# EasyEDA Pro project ChatBOT板子.epro

# Schematic Schematic1
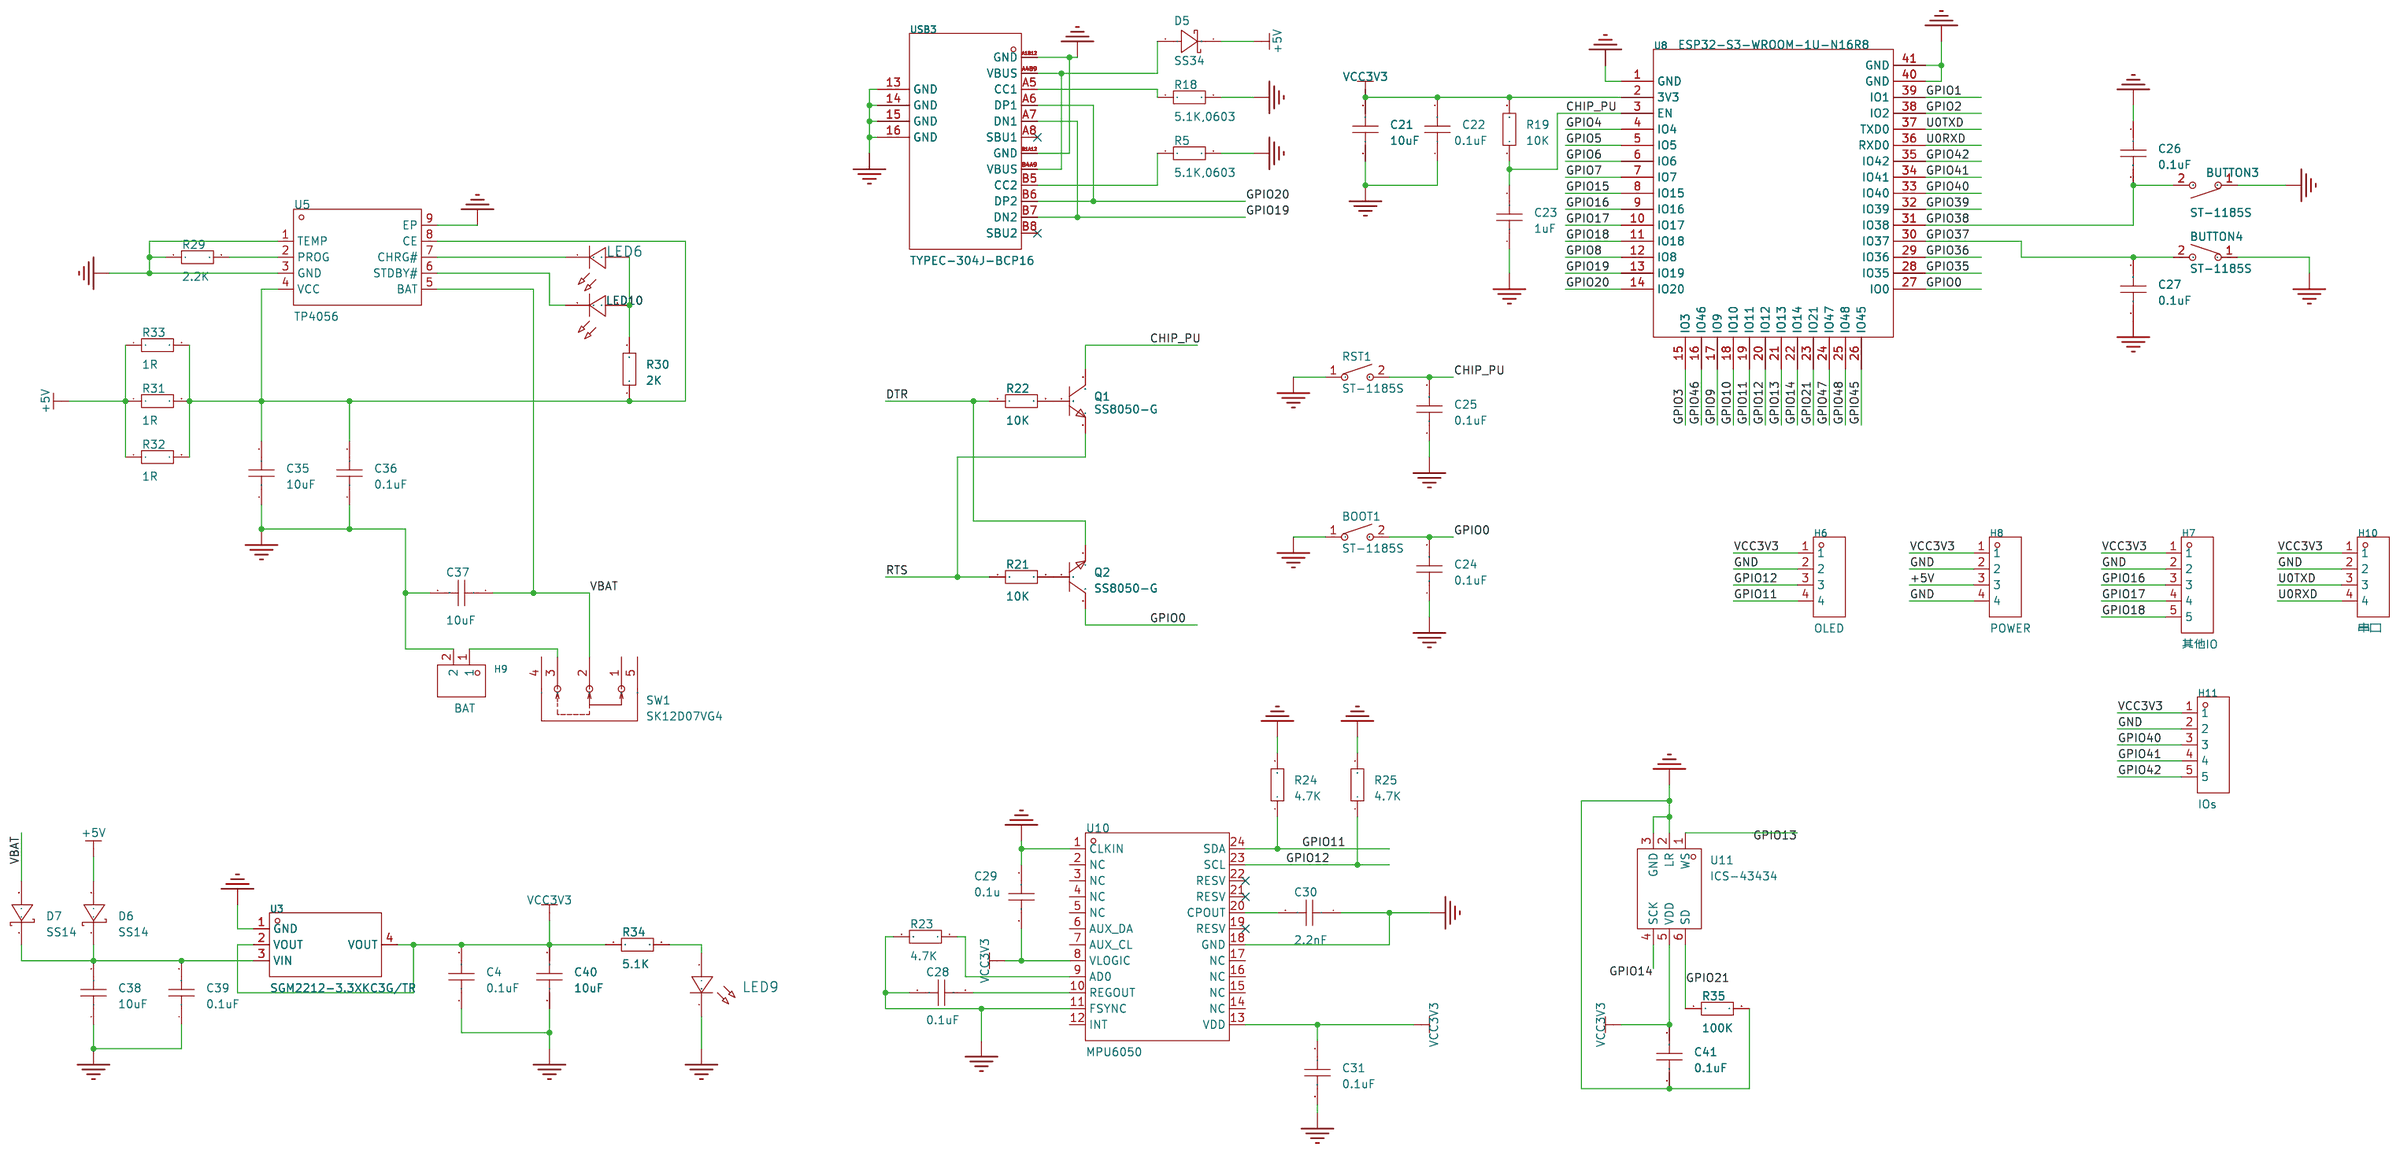
[diagram p0: schematic sheet]

## Parts
BOOT1  ST-1185S  [SW-SMD_ST-1185S]
BUTTON3  ST-1185S  [SW-SMD_ST-1185S]
BUTTON4  ST-1185S  [SW-SMD_ST-1185S]
C4  0.1uF  [C0603]
C21  10uF  [C0603]
C22  0.1uF  [C0603]
C23  1uF  [C0603]
C24  0.1uF  [C0603]
C25  0.1uF  [C0603]
C26  0.1uF  [C0603]
C27  0.1uF  [C0603]
C28  0.1uF  [C0603]
C29  0.1u  [C0603]
C30  2.2nF  [C0603]
C31  0.1uF  [C0603]
C35  10uF  [C0603]
C36  0.1uF  [C0603]
C37  10uF  [C0603]
C38  10uF  [C0603]
C39  0.1uF  [C0603]
C40  10uF  [C0603]
C41  0.1uF  [C0603]
D5  SS34  [SMA_L4.3-W2.5-LS5.0-RD]
D6  SS14  [SMA_L4.2-W2.6-LS5.3-RD]
D7  SS14  [SMA_L4.2-W2.6-LS5.3-RD]
H6  OLED  [HDR-TH_4P-P2.54-V-M]
H7  其他IO  [HDR-TH_5P-P2.54-V-M]
H8  POWER  [HDR-TH_4P-P2.54-V-M]
H9  BAT  [HDR-TH_2P-P2.54-V-M]
H10  串口  [HDR-TH_4P-P2.54-V-M]
H11  IOs  [HDR-TH_5P-P2.54-V-M]
LED6  -  [LED_0603]
LED9  -  [LED_0603]
LED10  -  [LED_0603]
Q1  SS8050-G  [SOT-23-3_L2.9-W1.6-P1.90-LS2.8-BR]
Q2  SS8050-G  [SOT-23-3_L2.9-W1.6-P1.90-LS2.8-BR]
R5  5.1K,0603  [R0603]
R18  5.1K,0603  [R0603]
R19  10K  [R0603]
R21  10K  [R0603]
R22  10K  [R0603]
R23  4.7K  [R0603]
R24  4.7K  [R0603]
R25  4.7K  [R0603]
R29  2.2K  [R0603]
R30  2K  [R0603]
R31  1R  [R0603]
R32  1R  [R0603]
R33  1R  [R0603]
R34  5.1K  [R0603]
R35  100K  [R0603]
RST1  ST-1185S  [SW-SMD_ST-1185S]
SW1  SK12D07VG4  [SW-TH_SK12D07VG4]
U3  SGM2212-3.3XKC3G/TR  [SOT-223-3_L6.5-W3.4-P2.30-LS7.0-BR]
U5  TP4056  [ESOP-8_L4.9-W3.9-P1.27-LS6.0-BL-EP]
U8  ESP32-S3-WROOM-1U-N16R8  [WIRELM-SMD_ESP32-S3-WROOM-1U]
U10  MPU6050  [QFN-24_L4.0-W4.0-P0.50-BL]
U11  ICS-43434  [MIC-SMD_6P-L3.5-W2.7-P0.90-TR]
USB3  TYPEC-304J-BCP16  [USB-C-SMD_TYPEC-304J-BCP16]

## Library data of the parts
BOOT1 BUTTON3 BUTTON4 RST1 = ST-1185S: 触点电流:50mA;额定电压(DC):12V;绝缘电阻:100MΩ;电路结构:单刀单掷;安装方式:立贴;机械寿命:10万次;带支架:否;; LCSC Part Name: 4*3*2mm 立贴 轻触开关; Supplier Part: C589191; Manufacturer: RISHENG(日昇); Supplier Footprint: SMD; JLCPCB Part Class: 扩展库; Datasheet: https://atta.szlcsc.com/upload/public/pdf/source/20200922/C589191_E74F821EA1C61BCC16EBC99CF1D66EDD.pdf; Supplier: LCSC; Circuit: 单刀单掷; Actuator Style: 圆形按钮; Mounting Style: 立贴; Switch Length: 4mm; Switch Width: 3mm; Switch Height: 2mm; Strike Gundam: 否; Contact Current: 50mA; Voltage Rating (DC): 12V; Insulation Resistance: 100MΩ; Actuator/Cap Color: 黑色; Pin Style: SMD接片; Mechanical Life: 10万次; Operating Temperature: -20℃~+70℃
C4 C21-C31 C35-C41 = CAP_0603: Supplier Footprint: 0603
D5 = SS34_C727060: 二极管配置:独立式;直流反向耐压(Vr):40V;平均整流电流(Io):3A;正向压降(Vf):550mV@3A;; LCSC Part Name: 40V 3A 550mV@3A; Supplier Part: C727060; Manufacturer: TWGMC(台湾迪嘉); Supplier Footprint: SMA; JLCPCB Part Class: 扩展库; Datasheet: https://atta.szlcsc.com/upload/public/pdf/source/20200828/C727059_6599B6CAC5F3238B9C33E46794659DBE.pdf; Supplier: LCSC; Diode Configuration: 独立式; Forward Voltage (Vf@If): 550mV@3A; Reverse Voltage (Vr): 40V; Average Rectified Current (Io): 3A; Reverse Leakage Current (Ir): 500uA@40V
D6 D7 = SS14_C2480: 二极管配置:独立式;正向压降(Vf):550mV@1A;直流反向耐压(Vr):40V;平均整流电流(Io):1A;; LCSC Part Name: 电压:40V 电流:1A; Supplier Part: C2480; Manufacturer: MDD; Supplier Footprint: SMA(DO-214AC); JLCPCB Part Class: Basic Part; Datasheet: https://atta.szlcsc.com/upload/public/pdf/source/20230712/2DB6064CFBB99DE6DB116BEE8208BE66.pdf; Supplier: LCSC; Diode Configuration: 独立式; Forward Voltage (Vf@If): 550mV@1A; Reverse Voltage (Vr): 40V; Average Rectified Current (Io): 1A; Reverse Leakage Current (Ir): 500uA@40V
H6 H8 H10 = PZ254V-11-04P: 排数:单排;总PIN位数:4P;间距:2.54mm;插针结构:1x4P;行距:-;安装类型:直插;圆针/方针:方针;额定电流:3A;额定电压:250V;配合针长度:6mm;塑高:2.5mm;端接针长度:3mm;触头材质:-;工作温度范围:-40℃~+105℃;颜色:黑色;; LCSC Part Name: 2.54mm 1x4P 直插 方针; Supplier Part: C2691448; Manufacturer: XFCN(兴飞); Supplier Footprint: 插件,P=2.54mm; JLCPCB Part Class: 扩展库; Datasheet: https://atta.szlcsc.com/upload/public/pdf/source/20200309/C492403_F9F19131791D08044AD4F84F8E751A34.pdf; Supplier: LCSC; Number of Rows: 单排; Number of Pins: 4P; Pitch: 2.54mm; Pin Structure: 1x4P; Mounting Type: 直插; Circluar Pins/Square Pins: 方针; Current Rating (Max): 3A; Voltage Rating (Max): 250V; Length of Mating Pin: 6mm; Insulation Height: 2.5mm; Length of End Connection Pin: 3mm; Operating Temperature Range: -40℃~+105℃; Color: 黑色
H7 H11 = PZ254V-11-05P: 排数:单排;总PIN位数:5P;间距:2.54mm;插针结构:1x5P;行距:-;安装类型:直插;圆针/方针:方针;额定电流:-;额定电压:-;配合针长度:6mm;塑高:2.5mm;端接针长度:3mm;触头材质:黄铜;触头镀层:-;工作温度范围:-40℃~+105℃;颜色:黑色;; LCSC Part Name: 2.54mm 1x5P 直插 方针; Supplier Part: C492404; Manufacturer: XFCN(兴飞); Supplier Footprint: 插件,P=2.54mm; JLCPCB Part Class: 扩展库; Datasheet: https://atta.szlcsc.com/upload/public/pdf/source/20200309/C492404_E51533260F8710EFF5D4617281164C1D.pdf; Supplier: LCSC; Pin Structure: 1x5P; Pitch: 2.54mm; Circluar Pins/Square Pins: 方针; Mounting Type: 直插; Number of Rows: 单排; Number of Pins: 5P; Length of Mating Pin: 6mm; Insulation Height: 2.5mm; Length of End Connection Pin: 3mm; Contact Material: 黄铜; Operating Temperature Range: -40℃~+105℃; Color: 黑色
H9 = PZ254V-11-02P: 排数:单排;总PIN位数:2P;间距:2.54mm;插针结构:1x2P;行距:-;安装类型:直插;圆针/方针:方针;额定电流:-;额定电压:-;配合针长度:6mm;塑高:2.5mm;端接针长度:3mm;触头材质:黄铜;触头镀层:-;工作温度范围:-40℃~+105℃;颜色:黑色;; LCSC Part Name: 2.54mm 1x2P 直插 方针; Supplier Part: C492401; Manufacturer: XFCN(兴飞); Supplier Footprint: 插件,P=2.54mm; JLCPCB Part Class: Extended Part; Datasheet: https://atta.szlcsc.com/upload/public/pdf/source/20200309/C492401_A812433581A9B211A7FFA413ADDFF0E5.pdf; Supplier: LCSC; Number of Rows: 单排; Number of Pins: 2P; Pitch: 2.54mm; Pin Structure: 1x2P; Mounting Type: 直插; Circluar Pins/Square Pins: 方针; Length of Mating Pin: 6mm; Insulation Height: 2.5mm; Length of End Connection Pin: 3mm; Contact Material: 黄铜; Operating Temperature Range: -40℃~+105℃; Color: 黑色
LED6 LED9 = LED_0603-R: Supplier Footprint: 0603
LED10 = LED_0603-G: Supplier Footprint: 0603
Q1 Q2 = SS8050-G_C164886: 晶体管类型:NPN;集射极击穿电压(Vceo):25V;集电极电流(Ic):1.5A;功率(Pd):300mW;直流电流增益(hFE@Ic,Vce):120@100mA,1V;; LCSC Part Name: NPN 25V 1.5A L档(120-200); Supplier Part: C164886; Manufacturer: CJ(江苏长电/长晶); Supplier Footprint: SOT-23; JLCPCB Part Class: 扩展库; Datasheet: https://atta.szlcsc.com/upload/public/pdf/source/20171228/C164886_15144412883891213890.pdf; Supplier: LCSC; Transistor Type: NPN; Collector-Emitter Breakdown Voltage (Vceo): 25V; Collector Current (Ic): 1.5A; Power Dissipation (Pd): 300mW; Collector Cut-Off Current (Icbo): 100nA; Collector-Emitter Saturation Voltage (VCE(sat)@Ic,Ib): 500mV@800mA,80mA; DC Current Gain (hFE@Ic,Vce): 120@100mA,1V; Transition Frequency (fT): 100MHz; Operating Temperature: +150℃@(Tj)
R5 R18 R19 R21-R25 R29-R35 = Res_0603: Supplier Footprint: 0603
SW1 = SK12D07VG4: 电路结构:单刀双掷;安装方式:卧插;额定电流(DC):500mA;额定电压(DC):50V;额定电流(AC):-;额定电压(AC):-;机械寿命:5千次;; LCSC Part Name: 3脚2档位 卧插 滑动开关; Supplier Part: C393937; Manufacturer: SHOU HAN(首韩); Supplier Footprint: 插件; JLCPCB Part Class: 扩展库; Datasheet: https://atta.szlcsc.com/upload/public/pdf/source/20190521/C393937_939FE26E571CC67D2D532E953108A1B0.pdf; Supplier: LCSC; Circuit: 单刀双掷; Actuator Style: 矩形柱状; Pin Style: PC引脚; Switch Height: 8.8mm; Mounting Style: 卧插; Current Rating (DC): 500mA; Voltage Rating (DC): 50V; Mechanical Life: 5千次
U3 = SGM2212-3.3XKC3G/TR_C3294699: Supplier Part: C3294699; Manufacturer: SGMICRO(圣邦微); Supplier Footprint: SOT-223; JLCPCB Part Class: 扩展库; Supplier: LCSC
U5 = TP4056_C725790: Supplier Part: C725790; Manufacturer: UMW(友台半导体); Supplier Footprint: ESOP-8; JLCPCB Part Class: 扩展库; Datasheet: https://atta.szlcsc.com/upload/public/pdf/source/20231109/CF74897CE79A500F7FE27A45ADCCC631.pdf; Supplier: LCSC
U8 = ESP32-S3-WROOM-1U-N16R8: Supplier Part: C3013946; Manufacturer: ESPRESSIF(乐鑫); Supplier Footprint: SMD,18x19.2mm; JLCPCB Part Class: 扩展库; Datasheet: https://atta.szlcsc.com/upload/public/pdf/source/20240130/9D71F4DF55874C504AB629FEEE3F038E.pdf; Supplier: LCSC
U10 = MPU6050: Supplier Part: C9900042518; Supplier Footprint: QFN-24_L4.0-W4.0-P0.50-BL-EP2.7; Supplier: LCSC
U11 = ICS-43434_1: 方向:全指向;信噪比:64dB;灵敏度:-;; Supplier Part: C5656610; Manufacturer: TDK InvenSense(应美盛); JLCPCB Part Class: 扩展库; Datasheet: https://atta.szlcsc.com/upload/public/pdf/source/231023/DS-000069-ICS-43434-v1.2-8194c7772d771e21a553109502704f97.pdf; Supplier: LCSC; Direction: 全指向; Supply Voltage: 1.65V~3.63V; Current Consumption: 550uA; SNR(Signal to Noise Ratio): 64dB
USB3 = TYPEC-304J-BCP16: 连接器类型:Type-C;标准:USB 3.1;公母:母座;触点数量:16;端口数量:1;安装方式:卧贴;额定电流 - 电源:5A;工作温度范围:-40℃~+85℃;焊接温度(最大值):260℃;; LCSC Part Name: Type-C 母座 卧贴 脚长2.0; Supplier Part: C2835315; Manufacturer: XUNPU(讯普); Supplier Footprint: SMD,8.94x7.35x3.16mm; JLCPCB Part Class: 扩展库; Datasheet: https://atta.szlcsc.com/upload/public/pdf/source/20210528/C2835315_A76BD3CF9329D12B6041421AD23BFD66.pdf; Supplier: LCSC; Connector Type: Type-C; Standard: USB 3.1; Gender: 母座; Number of Ports: 1; Number of Contacts: 16; Mounting Style: 卧贴; Current Rating - Power (Max): 5A; Operating Temperature Range: -40℃~+85℃; Soldering Temperature(Max): 260℃; Welding Temperature (Max): 260℃

## Nets
+5V: D5.1(C) D6.2(A) H8.3 R31.1 R32.1 R33.1
GND: BOOT1.1 BUTTON3.1 BUTTON4.1 C4.1 C21.1 C22.1 C23.1 C24.1 C25.1 C26.1 C27.1 C28.1 C29.1 C30.1 C31.2 C35.1 C36.1 C37.2 C38.1 C39.1 C40.1 C41.1 H6.2 H7.2 H8.2 H8.4 H9.2 H10.2 H11.2 LED9.1(C) R5.2 R18.2 R23.2 R24.2 R25.2 R29.1 R35.2 RST1.1 U3.1(GND) U5.1(TEMP) U5.3(GND) U5.9(EP) U8.1(GND) U8.40(GND) U8.41(GND) U10.1(CLKIN) U10.11(FSYNC) U10.18(GND) U11.2(LR) U11.3(GND) USB3.13(GND) USB3.14(GND) USB3.15(GND) USB3.16(GND) USB3.A1B12(GND) USB3.B1A12(GND)
VBAT: C37.1 D7.2(A) SW1.2 U5.5(BAT)
VCC3V3: C4.2 C21.2 C22.2 C29.2 C31.1 C40.2 C41.2 H6.1 H7.1 H8.1 H10.1 H11.1 R19.2 R34.1 U3.2(VOUT) U3.4(VOUT) U8.2(3V3) U10.8(VLOGIC) U10.13(VDD) U11.5(VDD)
CHIP_PU: C23.2 C25.2 Q1.3(C) R19.1 RST1.2 U8.3(EN)
DTR: Q2.2(E) R22.1
GPIO0: BOOT1.2 C24.2 Q2.3(C) U8.27(IO0)
GPIO1: U8.39(IO1)
GPIO2: U8.38(IO2)
GPIO3: U8.15(IO3)
GPIO4: U8.4(IO4)
GPIO5: U8.5(IO5)
GPIO6: U8.6(IO6)
GPIO7: U8.7(IO7)
GPIO8: U8.12(IO8)
GPIO9: U8.17(IO9)
GPIO10: U8.18(IO10)
GPIO11: H6.4 R24.1 U8.19(IO11) U10.24(SDA)
GPIO12: H6.3 R25.1 U8.20(IO12) U10.23(SCL)
GPIO13: U8.21(IO13) U11.1(WS)
GPIO14: U8.22(IO14) U11.4(SCK)
GPIO15: U8.8(IO15)
GPIO16: H7.3 U8.9(IO16)
GPIO17: H7.4 U8.10(IO17)
GPIO18: H7.5 U8.11(IO18)
GPIO19: U8.13(IO19) USB3.A7(DN1) USB3.B7(DN2)
GPIO20: U8.14(IO20) USB3.A6(DP1) USB3.B6(DP2)
GPIO21: R35.1 U8.23(IO21) U11.6(SD)
GPIO35: U8.28(IO35)
GPIO36: U8.29(IO36)
GPIO37: BUTTON4.2 C27.2 U8.30(IO37)
GPIO38: BUTTON3.2 C26.2 U8.31(IO38)
GPIO39: U8.32(IO39)
GPIO40: H11.3 U8.33(IO40)
GPIO41: H11.4 U8.34(IO41)
GPIO42: H11.5 U8.35(IO42)
GPIO45: U8.26(IO45)
GPIO46: U8.16(IO46)
GPIO47: U8.24(IO47)
GPIO48: U8.25(IO48)
RTS: Q1.2(E) R21.1
U0RXD: H10.4 U8.36(RXD0)
U0TXD: H10.3 U8.37(TXD0)
$1N12556: D5.2(A) USB3.A4B9(VBUS) USB3.B4A9(VBUS)
$1N12557: R18.1 USB3.A5(CC1)
$1N12558: R5.1 USB3.B5(CC2)
$1N12699: Q2.1(B) R21.2
$1N12700: Q1.1(B) R22.2
$1N13120: R23.1 U10.9(AD0)
$1N13127: C30.2 U10.20(CPOUT)
$1N14902: LED9.2(A) R34.2
$1N14905: R29.2 U5.2(PROG)
$1N14907: LED6.1(C) U5.7(CHRG#)
$1N14908: LED10.1(C) U5.6(STDBY#)
$1N14909: LED6.2(A) LED10.2(A) R30.2
$1N14916: C38.2 C39.2 D6.1(K) D7.1(K) U3.3(VIN)
$1N14919: C35.2 C36.2 R30.1 R31.2 R32.2 R33.2 U5.4(VCC) U5.8(CE)
$1N14937: H9.1 SW1.3
$1N18410: C28.2 U10.10(REGOUT)

Not connected (* = marked no-connect by the designer): SW1 1 4 5; U10 2(NC) 3(NC) 4(NC) 5(NC) 6(AUX_DA) 7(AUX_CL) 12(INT) 14(NC) 15(NC) 16(NC) 17(NC) 19(RESV)* 21(RESV)* 22(RESV)*; USB3 A8(SBU1)* B8(SBU2)*

# Board PCB2
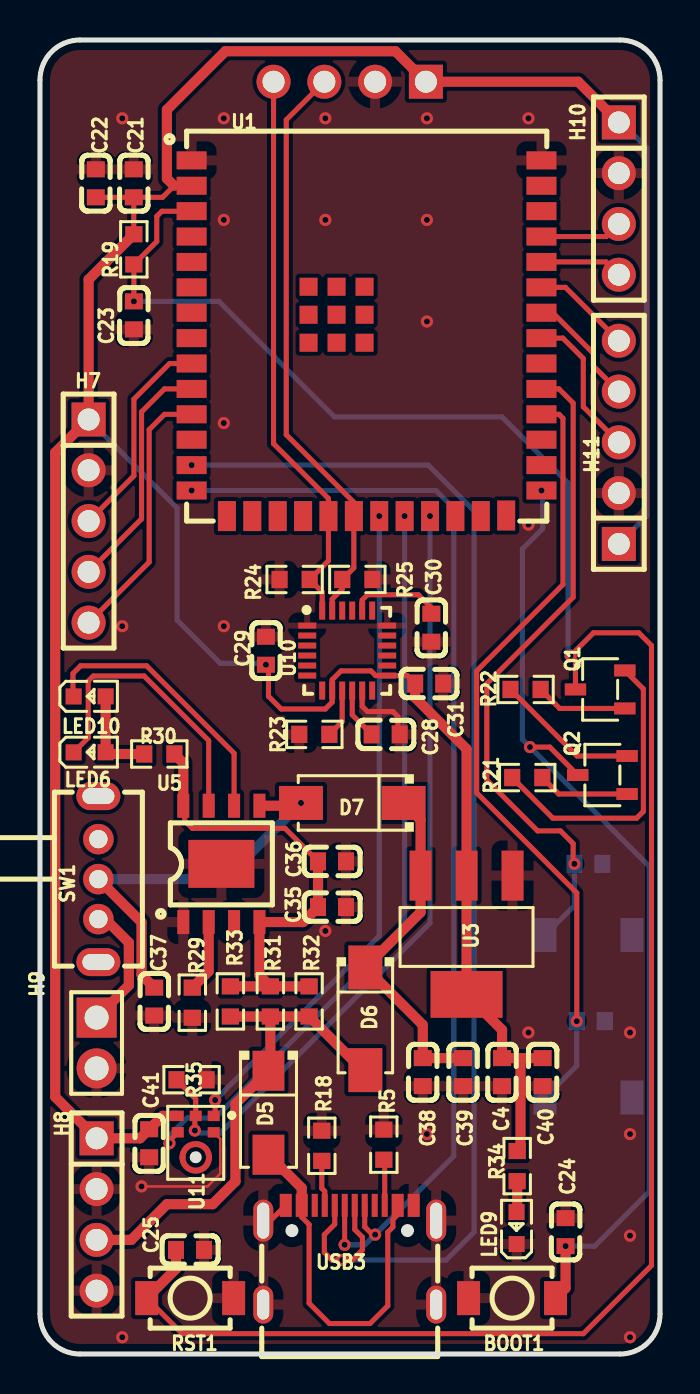
[diagram p1: board, top side]
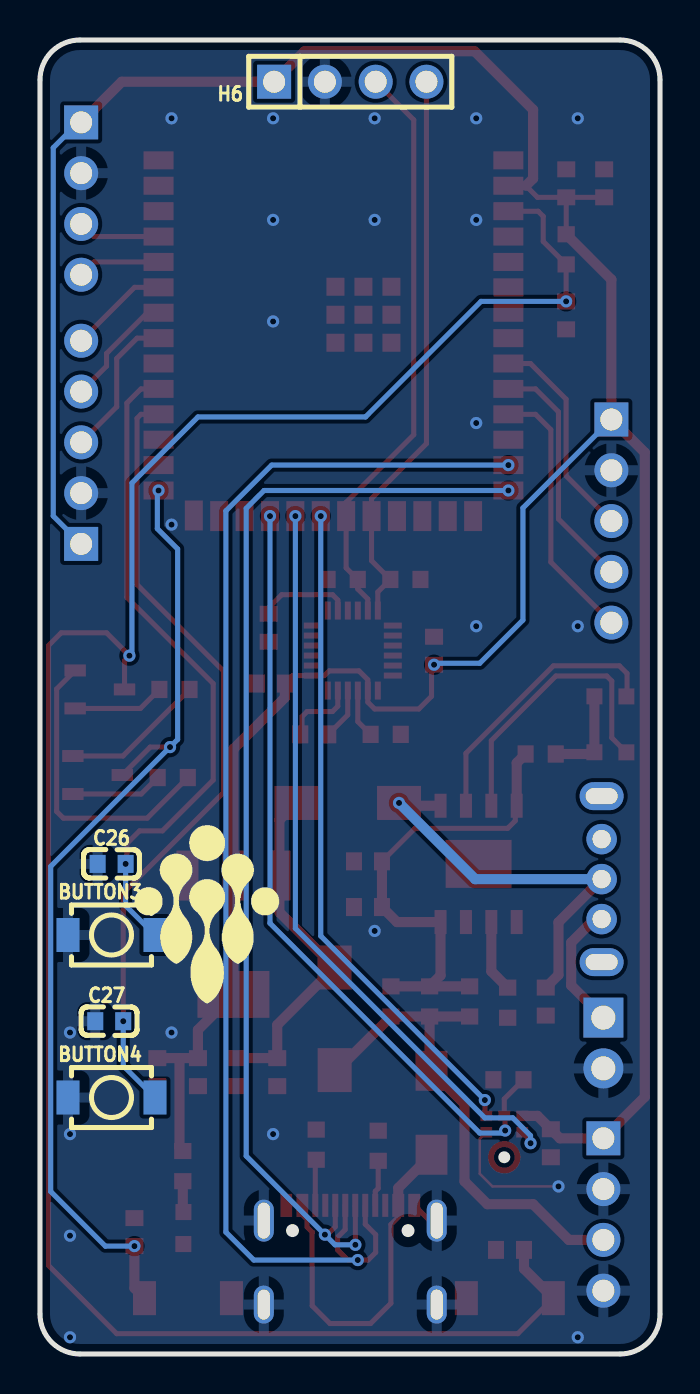
[diagram p2: board, bottom side, seen from below]

Outline 31.02 x 65.72 mm; copper layers: Top Layer, Bottom Layer. Coordinates in mm from the lower left corner of the outline.
Outline path: 0,63.72 0,2 arc(0.59,0.59) 2,0 29.02,0 arc(30.43,0.59) 31.02,2 31.02,63.72 arc(30.43,65.13) 29.02,65.72 2,65.72 arc(0.59,65.13) 0,63.72
Stack: Top Layer 0.035mm / Dielectric1 1.51mm FR4 er 4.5 / Bottom Layer 0.035mm

## Design rules (mm)
template: JLCPCB Capability(Two Layers Board)
spacing copperThickness1oz (default): track to track 0.102, other pairs 0.152 to 0.3
spacing copperThickness2oz: track to track 0.203, other pairs 0.152 to 0.3
track width copperThickness1oz (default): min 0.127, default 0.254, max 2.54
track width copperThickness2oz: min 0.203, default 0.254, max 2.54
differential pair differentialPair (default): width min 0.127, default 0.254, max 2.54; gap min 0.152, default 0.152
via viaSize (default): diameter min 0.5, default 0.61, max 10; hole min 0.3, default 0.305, max 6.3

## Placement (name value [footprint] x y rotation side)
BOOT1  ST-1185S  [SW-SMD_ST-1185S]  23.61 2.79 0 top
BUTTON3  ST-1185S  [SW-SMD_ST-1185S]  27.44 20.95 180 bottom
BUTTON4  ST-1185S  [SW-SMD_ST-1185S]  27.44 12.83 180 bottom
C4  0.1uF  [C0603]  23.11 14.1 90 top
C21  10uF  [C0603]  4.69 58.55 270 top
C22  0.1uF  [C0603]  2.79 58.55 270 top
C23  1uF  [C0603]  4.7 51.94 90 top
C24  0.1uF  [C0603]  26.29 6.1 270 top
C25  0.1uF  [C0603]  7.5 5.21 180 top
C26  0.1uF  [C0603]  27.43 24.51 180 bottom
C27  0.1uF  [C0603]  27.55 16.64 180 bottom
C28  0.1uF  [C0603]  17.29 30.99 180 top
C29  0.1u  [C0603]  11.3 35.17 270 top
C30  2.2nF  [C0603]  19.58 36.32 90 top
C31  0.1uF  [C0603]  19.47 33.53 0 top
C35  10uF  [C0603]  14.61 22.35 180 top
C36  0.1uF  [C0603]  14.61 24.64 180 top
C37  10uF  [C0603]  5.72 17.62 270 top
C38  10uF  [C0603]  19.15 14.1 90 top
C39  0.1uF  [C0603]  21.16 14.1 90 top
C40  10uF  [C0603]  25.15 14.1 90 top
C41  0.1uF  [C0603]  5.46 10.54 90 top
D5  SS34  [SMA_L4.3-W2.5-LS5.0-RD]  11.43 12.06 270 top
D6  SS14  [SMA_L4.2-W2.6-LS5.3-RD]  16.28 16.76 270 top
D7  SS14  [SMA_L4.2-W2.6-LS5.3-RD]  15.62 27.56 180 top
H6  OLED  [HDR-TH_4P-P2.54-V-M]  15.49 63.63 180 bottom
H7  其他IO  [HDR-TH_5P-P2.54-V-M]  2.43 41.66 270 top
H8  POWER  [HDR-TH_4P-P2.54-V-M]  2.83 6.98 270 top
H9  BAT  [HDR-TH_2P-P2.54-V-M]  2.83 15.55 270 top
H10  串口  [HDR-TH_4P-P2.54-V-M]  28.96 57.78 270 top
H11  IOs  [HDR-TH_5P-P2.54-V-M]  28.96 45.59 90 top
LED6  -  [LED_0603]  2.53 30.1 0 top
LED9  -  [LED_0603]  23.83 6.35 90 top
LED10  -  [LED_0603]  2.53 32.9 0 top
Q1  SS8050-G  [SOT-23-3_L2.9-W1.6-P1.90-LS2.8-BR]  28.02 33.23 0 top
Q2  SS8050-G  [SOT-23-3_L2.9-W1.6-P1.90-LS2.8-BR]  28.13 28.96 0 top
R5  5.1K,0603  [R0603]  17.2 10.47 90 top
R18  5.1K,0603  [R0603]  14.1 10.41 90 top
R19  10K  [R0603]  4.69 55.25 90 top
R21  10K  [R0603]  24.37 28.83 0 top
R22  10K  [R0603]  24.29 33.23 0 top
R23  4.7K  [R0603]  13.72 30.99 180 top
R24  4.7K  [R0603]  12.74 38.73 180 top
R25  4.7K  [R0603]  15.88 38.73 0 top
R29  2.2K  [R0603]  7.62 17.57 90 top
R30  2K  [R0603]  5.97 30.01 180 top
R31  1R  [R0603]  11.53 17.63 90 top
R32  1R  [R0603]  13.46 17.63 90 top
R33  1R  [R0603]  9.53 17.63 90 top
R34  5.1K  [R0603]  23.87 9.4 270 top
R35  100K  [R0603]  7.58 13.72 0 top
RST1  ST-1185S  [SW-SMD_ST-1185S]  7.51 2.79 180 top
SW1  SK12D07VG4  [SW-TH_SK12D07VG4]  2.92 23.75 270 top
U1  ESP32-S3-WROOM-1U-N16R8  [wirelm-smd_esp32-s3-wroom-1u]  16.34 50.8 0 top
U3  SGM2212-3.3XKC3G/TR  [SOT-223-3_L6.5-W3.4-P2.30-LS7.0-BR]  21.34 20.95 90 top
U5  TP4056  [ESOP-8_L4.9-W3.9-P1.27-LS6.0-BL-EP]  9.07 24.51 0 top
U10  MPU6050  [QFN-24_L4.0-W4.0-P0.50-BL]  15.37 35.18 270 top
U11  ICS-43434  [MIC-SMD_6P-L3.5-W2.7-P0.90-TR]  7.79 10.54 0 top
USB3  TYPEC-304J-BCP16  [USB-C-SMD_TYPEC-304J-BCP16]  15.49 4.95 0 top

## Footprints (pads in the part's own frame, mm; a bottom-side part is the same pattern mirrored in y, then rotated)
C0603
  rect 0.8x0.9 smd: 1(-0.7,0) 2(0.7,0)
ESOP-8_L4.9-W3.9-P1.27-LS6.0-BL-EP
  rect 0.6x1.2 smd: 1(-1.905,-2.909) 2(-0.635,-2.909) 3(0.635,-2.909) 4(1.905,-2.909) 5(1.905,2.909) 6(0.635,2.909) 7(-0.635,2.909) 8(-1.905,2.909)
  rect 3.3x2.4 smd: 9(0,0)
HDR-TH_2P-P2.54-V-M
  rect 2x2 hole 1.2: 1(-1.27,0)
  round 2 hole 1.2: 2(1.27,0)
HDR-TH_4P-P2.54-V-M
  rect 1.7x1.7 hole 1.1: 1(-3.81,0)
  round 1.7 hole 1.1: 2(-1.27,0) 3(1.27,0) 4(3.81,0)
HDR-TH_5P-P2.54-V-M
  rect 1.7x1.7 hole 1.1: 1(-5.08,0)
  round 1.7 hole 1.1: 2(-2.54,0) 3(0,0) 4(2.54,0) 5(5.08,0)
LED_0603
  rect 0.8x0.8 smd: 1(-0.851,-0.01) 2(0.75,-0.005)
MIC-SMD_6P-L3.5-W2.7-P0.90-TR
  rect 0.6x0.52 smd: 1(0.9,1.367) 2(0.9,0.545) 4(-0.9,0.545) 5(-0.9,1.367) 6(0,1.367)
  custom 1.626x0.963 smd: 3(0,-0.042)
  custom 1.626x0.966 smd: 3(0,-1.367)
QFN-24_L4.0-W4.0-P0.50-BL
  rect 0.3x0.9 smd: 1(-1.25,-2) 2(-0.75,-2) 3(-0.25,-2) 4(0.25,-2) 5(0.75,-2) 6(1.25,-2) 13(1.25,2) 14(0.75,2) 15(0.25,2) 16(-0.25,2) 17(-0.75,2) 18(-1.25,2)
  rect 0.9x0.3 smd: 7(2,-1.25) 8(2,-0.75) 9(2,-0.25) 10(2,0.25) 11(2,0.75) 12(2,1.25) 19(-2,1.25) 20(-2,0.75) 21(-2,0.25) 22(-2,-0.25) 23(-2,-0.75) 24(-2,-1.25)
R0603
  rect 0.806x0.864 smd: 1(-0.753,0) 2(0.753,0)
SMA_L4.2-W2.6-LS5.3-RD
  rect 2.2x1.7 smd: 1(-2.566,0) 2(2.566,0)
SMA_L4.3-W2.5-LS5.0-RD
  rect 2x1.593 smd: 1(-2.1,0) 2(2.1,0)
SOT-23-3_L2.9-W1.6-P1.90-LS2.8-BR
  rect 1.07x0.6 smd: 1(1.235,-0.95) 2(1.235,0.95) 3(-1.235,0)
SOT-223-3_L6.5-W3.4-P2.30-LS7.0-BR
  rect 2.5x1.1 smd: 1(2.97,-2.3) 2(2.97,0) 3(2.97,2.3)
  rect 2.34x3.6 smd: 4(-2.97,0)
SW-SMD_ST-1185S
  rect 1.15x1.7 smd: 1(-2.175,0) 2(2.175,0)
SW-TH_SK12D07VG4
  round 1.524 hole 0.914: 1(-2,0) 2(0,0) 3(2,0)
  oval 1.4x2.2 hole 0.8x1.6: 4(4.15,0) 5(-4.15,0)
USB-C-SMD_TYPEC-304J-BCP16
  oval 1x2.1 hole 0.6x1.8: 13(-4.325,1.718) 14(4.325,1.718)
  oval 1x1.9 hole 0.6x1.5: 15(-4.325,-2.482) 16(4.325,-2.482)
  rect 0.6x1.15 smd: A1B12(-3.2,2.482) A4B9(-2.4,2.482) B1A12(3.2,2.482) B4A9(2.4,2.482)
  rect 0.3x1.15 smd: A5(-1.25,2.482) A6(-0.25,2.482) A7(0.25,2.482) A8(1.25,2.482) B5(1.75,2.482) B6(0.75,2.482) B7(-0.75,2.482) B8(-1.75,2.482)
wirelm-smd_esp32-s3-wroom-1u
  rect 1.5x0.9 smd: 1(-8.75,8.895) 2(-8.75,7.625) 3(-8.75,6.355) 4(-8.75,5.085) 5(-8.75,3.815) 6(-8.75,2.545) 7(-8.75,1.275) 8(-8.75,0.005) 9(-8.75,-1.265) 10(-8.75,-2.535) 11(-8.75,-3.805) 12(-8.75,-5.075) 13(-8.75,-6.345) 14(-8.75,-7.615) 27(8.75,-7.615) 28(8.75,-6.345) 29(8.75,-5.075) 30(8.75,-3.805) 31(8.75,-2.535) 32(8.75,-1.265) 33(8.75,0.005) 34(8.75,1.275) 35(8.75,2.545) 36(8.75,3.815) 37(8.75,5.085) 38(8.75,6.355) 39(8.75,7.625) 40(8.75,8.895)
  rect 0.9x1.5 smd: 15(-6.985,-8.895) 16(-5.715,-8.895) 17(-4.445,-8.895) 18(-3.175,-8.895) 19(-1.905,-8.895) 20(-0.635,-8.895) 21(0.635,-8.895) 22(1.905,-8.895) 23(3.175,-8.895) 24(4.445,-8.895) 25(5.715,-8.895) 26(6.985,-8.865)
  rect 0.9x0.9 smd: 41(-2.9,2.575) 41(-2.9,1.175) 41(-2.9,-0.225) 41(-1.5,2.575) 41(-1.5,1.175) 41(-1.5,-0.225) 41(-0.1,2.575) 41(-0.1,1.175) 41(-0.1,-0.225)

## Nets
+5V: D5.1 D6.2 H8.3 R31.1 R32.1 R33.1
GND: BOOT1.1 BUTTON3.1 BUTTON4.1 C4.1 C21.1 C22.1 C23.1 C24.1 C25.1 C26.1 C27.1 C28.1 C29.1 C30.1 C31.2 C35.1 C36.1 C37.2 C38.1 C39.1 C40.1 C41.1 H6.2 H7.2 H8.2 H8.4 H9.2 H10.2 H11.2 LED9.1 R5.2 R18.2 R23.2 R24.2 R25.2 R29.1 R35.2 RST1.1 U1.1 U1.40 U1.41 U3.1 U5.1 U5.3 U5.9 U10.1 U10.11 U10.18 U11.2 U11.3 USB3.13 USB3.14 USB3.15 USB3.16 USB3.A1B12 USB3.B1A12
VBAT: C37.1 D7.2 SW1.2 U5.5
VCC3V3: C4.2 C21.2 C22.2 C29.2 C31.1 C40.2 C41.2 H6.1 H7.1 H8.1 H10.1 H11.1 R19.2 R34.1 U1.2 U3.2 U3.4 U10.8 U10.13 U11.5
CHIP_PU: C23.2 C25.2 Q1.3 R19.1 RST1.2 U1.3
DTR: Q2.2 R22.1
GPIO0: BOOT1.2 C24.2 Q2.3 U1.27
GPIO1: U1.39
GPIO2: U1.38
GPIO3: U1.15
GPIO4: U1.4
GPIO5: U1.5
GPIO6: U1.6
GPIO7: U1.7
GPIO8: U1.12
GPIO9: U1.17
GPIO10: U1.18
GPIO11: H6.4 R24.1 U1.19 U10.24
GPIO12: H6.3 R25.1 U1.20 U10.23
GPIO13: U1.21 U11.1
GPIO14: U1.22 U11.4
GPIO15: U1.8
GPIO16: H7.3 U1.9
GPIO17: H7.4 U1.10
GPIO18: H7.5 U1.11
GPIO19: U1.13 USB3.A7 USB3.B7
GPIO20: U1.14 USB3.A6 USB3.B6
GPIO21: R35.1 U1.23 U11.6
GPIO35: U1.28
GPIO36: U1.29
GPIO37: BUTTON4.2 C27.2 U1.30
GPIO38: BUTTON3.2 C26.2 U1.31
GPIO39: U1.32
GPIO40: H11.3 U1.33
GPIO41: H11.4 U1.34
GPIO42: H11.5 U1.35
GPIO45: U1.26
GPIO46: U1.16
GPIO47: U1.24
GPIO48: U1.25
RTS: Q1.2 R21.1
U0RXD: H10.4 U1.36
U0TXD: H10.3 U1.37
$1N12556: D5.2 USB3.A4B9 USB3.B4A9
$1N12557: R18.1 USB3.A5
$1N12558: R5.1 USB3.B5
$1N12699: Q2.1 R21.2
$1N12700: Q1.1 R22.2
$1N13120: R23.1 U10.9
$1N13127: C30.2 U10.20
$1N14902: LED9.2 R34.2
$1N14905: R29.2 U5.2
$1N14907: LED6.1 U5.7
$1N14908: LED10.1 U5.6
$1N14909: LED6.2 LED10.2 R30.2
$1N14916: C38.2 C39.2 D6.1 D7.1 U3.3
$1N14919: C35.2 C36.2 R30.1 R31.2 R32.2 R33.2 U5.4 U5.8
$1N14937: H9.1 SW1.3
$1N18410: C28.2 U10.10

Pads without a net: SW1 1 4 5; U10 2 3 4 5 6 7 12 14 15 16 17 19 21 22; USB3 A8 B8

## Via types
v1: diameter 0.61, hole 0.305, Top Layer to Bottom Layer, 42 vias

## Routing (per net, layer and track width the routed paths; a pad name or vN(x,y) marks a point on that pad's centre or on a via; arc(x,y) is an arc through that point)
+5V: length 25
  Top Layer w0.508: 11.53,16.88 13.46,16.88 16.14,14.2 D6.2 ; 11.53,16.88 11.53,14.26 D5.1 9.78,12.51 9.78,8.64 8.64,7.49 6.35,7.49 4.56,5.71 H8.3 ; 11.53,16.88 9.53,16.88
GND: length 11.6
  Top Layer w0.127: v1(5.08,8.38) 8.38,8.38 9.02,9.02 9.02,10.76 U11.2
  Top Layer w0.254: USB3.13 11.53,6.67 USB3.A1B12 ; C28.1 17.91,31.08 17.91,31.88 17.65,32.13 16.38,32.13 16.12,32.4 U10.11
  vias: v1(4.12,61.8) v1(4.12,36.4) v1(4.12,0.84) v1(9.19,61.8) v1(9.19,56.72) v1(9.19,46.56) v1(9.19,36.4) v1(14.28,61.8) v1(14.28,56.72) v1(14.28,21.16) v1(19.35,61.8) v1(19.35,56.72) v1(19.35,51.64) v1(19.35,11) v1(24.44,61.8) v1(24.44,41.48) v1(24.44,16.08) v1(29.51,16.08) v1(29.51,11) v1(29.51,5.92) v1(29.51,0.84)
VBAT: length 20.4
  Top Layer w0.508: v1(13.06,27.56) 12.92,27.42 U5.5 ; C37.1 5.08,18.96 5.08,21.59 SW1.2
  Bottom Layer w0.508: SW1.2 9.25,23.75 v1(13.06,27.56)
VCC3V3: length 166.1
  Top Layer w0.254: C22.2 C21.2 ; C21.2 4.69,56 R19.2 ; C21.2 6.13,57.85 6.71,58.42 U1.2 ; v1(11.3,34.47) 11.43,34.34 11.43,32.89 12.06,32.26 14.27,32.26 14.62,32.6 U10.8 14.62,33.72 15.06,34.16 16.56,34.16 16.79,33.93 U10.13 18.37,33.93 C31.1
  Top Layer w0.508: R34.1 24.04,10.32 24.04,14.8 ; 24.04,14.8 C4.2 23.11,16.21 U3.4 U3.2 21.34,30.25 18.77,32.82 C31.1 ; 24.04,14.8 C40.2 ; U11.5 6.13,11.91 C41.2 5.01,10.79 H8.1 0.76,12.86 0.76,45.08 2.41,46.74 H7.1 2.43,53.74 R19.2 ; 6.71,58.42 6.35,58.78 6.35,62.23 9.27,65.15 17.78,65.15 H6.1 26.92,63.63 H10.1
  Bottom Layer w0.254: H11.1 30.35,41.91 30.35,60.33 29.08,61.59 H10.1 ; v1(11.3,34.47) 11.23,34.54 9.02,34.54 6.86,36.7 6.86,42.31 H7.1
CHIP_PU: length 108.8
  Top Layer w0.254: v1(4.7,52.64) 4.7,54.49 R19.1 5.84,55.64 5.84,56.9 6.1,57.15 7.58,57.15 U1.3 ; Q1.3 26.79,34.68 v1(26.54,34.92) 27.69,36.07 29.95,36.07 30.59,35.43 30.59,4.43 27.18,1.02 7.12,1.02 RST1.2
  Top Layer w0.508: RST1.2 6.8,4.26 C25.2
  Bottom Layer w0.254: v1(26.54,34.92) 26.42,35.05 26.42,43.56 23.11,46.86 14.73,46.86 8.95,52.64 v1(4.7,52.64)
DTR: length 7.2
  Top Layer w0.254: Q2.2 26.87,29.91 R22.1
GPIO0: length 49.2
  Top Layer w0.254: 26.9,28.96 25.5,30.35 v1(24.51,30.35)
  Top Layer w0.508: v1(26.29,5.4) 26.29,3.3 25.79,2.79
  Bottom Layer w0.254: v1(25.09,43.19) 25.15,43.12 25.15,41.28 24.13,40.26 24.13,30.73 v1(24.51,30.35) 30.48,24.38 30.48,8.13 27.75,5.4 v1(26.29,5.4)
GPIO11: length 28.2
  Top Layer w0.254: U10.24 14.12,38.11 R24.1 14.43,39.67 U1.19 14.43,42.78 11.68,45.53 H6.4
GPIO12: length 29.1
  Top Layer w0.254: H6.3 12.32,61.72 12.32,45.97 15.7,42.59 U1.20 15.7,39.31 R25.1 15.12,38.26 14.62,37.76 U10.23
GPIO13: length 33.4
  Top Layer w0.254: v1(8.76,12.7) 8.76,11.98 U11.1
  Bottom Layer w0.254: v1(8.76,12.7) 16.97,20.91 v1(16.97,41.91)
GPIO14: length 37.8
  Top Layer w0.254: U11.4 6.48,10.67 v1(6.48,10.54)
  Bottom Layer w0.254: v1(18.24,41.91) 18.24,21.29 8.76,11.81 7.37,11.81 6.48,10.92 v1(6.48,10.54)
GPIO16: length 10.7
  Top Layer w0.254: U1.9 6.48,49.53 4.7,47.75 4.7,43.92 H7.3
GPIO17: length 12.1
  Top Layer w0.254: H7.4 5.08,41.76 5.08,47.12 6.23,48.27 U1.10
GPIO18: length 13.3
  Top Layer w0.254: H7.5 5.46,39.6 5.46,46.23 6.23,47 7.59,47
GPIO19: length 65.6
  Top Layer w0.254: USB3.A7 15.75,7.43 15.75,6.22 16.13,5.84 16.13,5.21 15.62,4.7 v1(15.12,4.7) 14.6,4.7 14.22,5.08 14.22,5.97 14.74,6.49 USB3.B7
  Bottom Layer w0.254: v1(7.59,44.45) 19.43,44.45 21.72,42.16 21.72,6.1 20.32,4.7 v1(15.12,4.7)
GPIO20: length 56.9
  Top Layer w0.254: v1(15.24,5.46) 15.24,7.43 USB3.A6 ; v1(16.76,5.97) 16.64,5.97 16.24,6.36 USB3.B6
  Bottom Layer w0.254: v1(7.59,43.19) 19.81,43.19 20.7,42.29 20.7,9.91 v1(16.76,5.97) 16.26,5.46 v1(15.24,5.46)
GPIO21: length 39.5
  Top Layer w0.254: v1(7.75,11.18) 7.75,11.86 U11.6 7.79,12.75 R35.1
  Bottom Layer w0.254: v1(7.75,11.18) 7.87,11.05 9.02,11.05 19.51,21.54 v1(19.51,41.91)
GPIO37: length 39.6
  Top Layer w0.254: v1(26.85,16.64) 26.85,23.06 21.84,28.07 21.84,34.16 26.16,38.48 26.16,46.8 25.96,47 25.09,47
  Bottom Layer w0.254: BUTTON4.2 26.85,14.41 v1(26.85,16.64)
GPIO38: length 33.4
  Top Layer w0.254: v1(26.73,24.51) 26.67,24.57 26.67,25.53 26.03,26.16 24.89,26.16 22.35,28.7 22.35,33.53 26.67,37.85 26.67,47.56 25.96,48.27 U1.31
  Bottom Layer w0.254: BUTTON3.2 26.73,22.42 v1(26.73,24.51)
GPIO40: length 7.4
  Top Layer w0.254: H11.3 27.18,47.37 27.18,49.78 26.16,50.81 U1.33
GPIO41: length 5.9
  Top Layer w0.254: U1.34 25.65,52.08 27.69,50.04 27.69,49.4 28.96,48.13
GPIO42: length 5
  Top Layer w0.254: H11.5 26.28,53.34 U1.35
RTS: length 15
  Top Layer w0.254: Q1.2 30.18,33.26 30.18,27.14 29.84,26.8 25.65,26.8 R21.1
U0RXD: length 4.1
  Top Layer w0.254: U1.36 28.32,54.61 H10.4
U0TXD: length 4.1
  Top Layer w0.254: H10.3 28.33,55.89 U1.37
$1N12556: length 18.2
  Top Layer w0.254: USB3.B4A9 17.89,6.97 17.65,6.73 17.65,6.35 17.4,6.1 17.4,2.41 16.51,1.52 14.48,1.52 13.46,2.54 13.46,6.48 13.09,6.84 USB3.A4B9
  Top Layer w0.508: D5.2 13.09,8.3 USB3.A4B9
$1N12557: length 2.3
  Top Layer w0.254: USB3.A5 14.24,8.14 14.1,8.28 R18.1
$1N12558: length 2.3
  Top Layer w0.254: R5.1 17.24,9.67 USB3.B5
$1N12699: length 4.6
  Top Layer w0.254: R21.2 25.95,28.01 Q2.1
$1N12700: length 4.6
  Top Layer w0.254: Q1.1 25.99,32.28 R22.2
$1N13120: length 2.5
  Top Layer w0.254: U10.9 15.12,31.63 R23.1
$1N13127: length 4.7
  Top Layer w0.254: C30.2 19.58,37.32 18.92,37.97 16.38,37.97 16.12,37.71 U10.20
$1N14902: length 1.6
  Top Layer w0.508: LED9.2 23.87,7.13 R34.2
$1N14905: length 3.6
  Top Layer w0.508: R29.2 8.44,19.14 U5.2
$1N14907: length 14.6
  Top Layer w0.254: 1.68,30.09 2.41,30.82 2.41,33.66 2.67,33.91 5.21,33.91 8.44,30.68 U5.7
$1N14908: length 13.8
  Top Layer w0.254: U5.6 9.71,30.04 5.33,34.42 2.03,34.42 1.65,34.04 1.65,32.92 1.68,32.89
$1N14909: length 4.8
  Top Layer w0.508: R30.2 3.37,30.01 LED6.2 LED10.2
$1N14916: length 17.5
  Top Layer w0.508: D7.1 19.04,26.71 U3.3 19.04,22.09 D6.1 19.15,16.46 C38.2 C39.2
$1N14919: length 24
  Top Layer w0.254: 13.91,24.64 12.26,26.29 7.62,26.29 7.24,26.67 7.24,27.35 U5.8
  Top Layer w0.508: U5.8 7.17,29.56 R30.1 ; 13.91,24.64 13.91,22.35 13.16,21.6 U5.4 10.98,18.93 R31.2 ; R33.2 R31.2 ; R31.2 R32.2
$1N14937: length 6.4
  Top Layer w0.508: SW1.3 3.27,21.75 4.44,20.57 4.44,18.44 H9.1
$1N18410: length 2.6
  Top Layer w0.254: C28.2 15.62,31.96 15.62,33.17 U10.10

## Copper pours and planes (outline as drawn; the poured copper is in the pictures)
GND on Top Layer: -1.78,67.06 33.04,67.06 33.04,-1.14 -1.78,-1.14
GND on Bottom Layer: -3.05,68.45 33.4,68.45 33.4,-1.14 -3.05,-1.14
